# EAGLE schematic page1 (EAGLE 7.7.0)

## Sheet 1 of 3
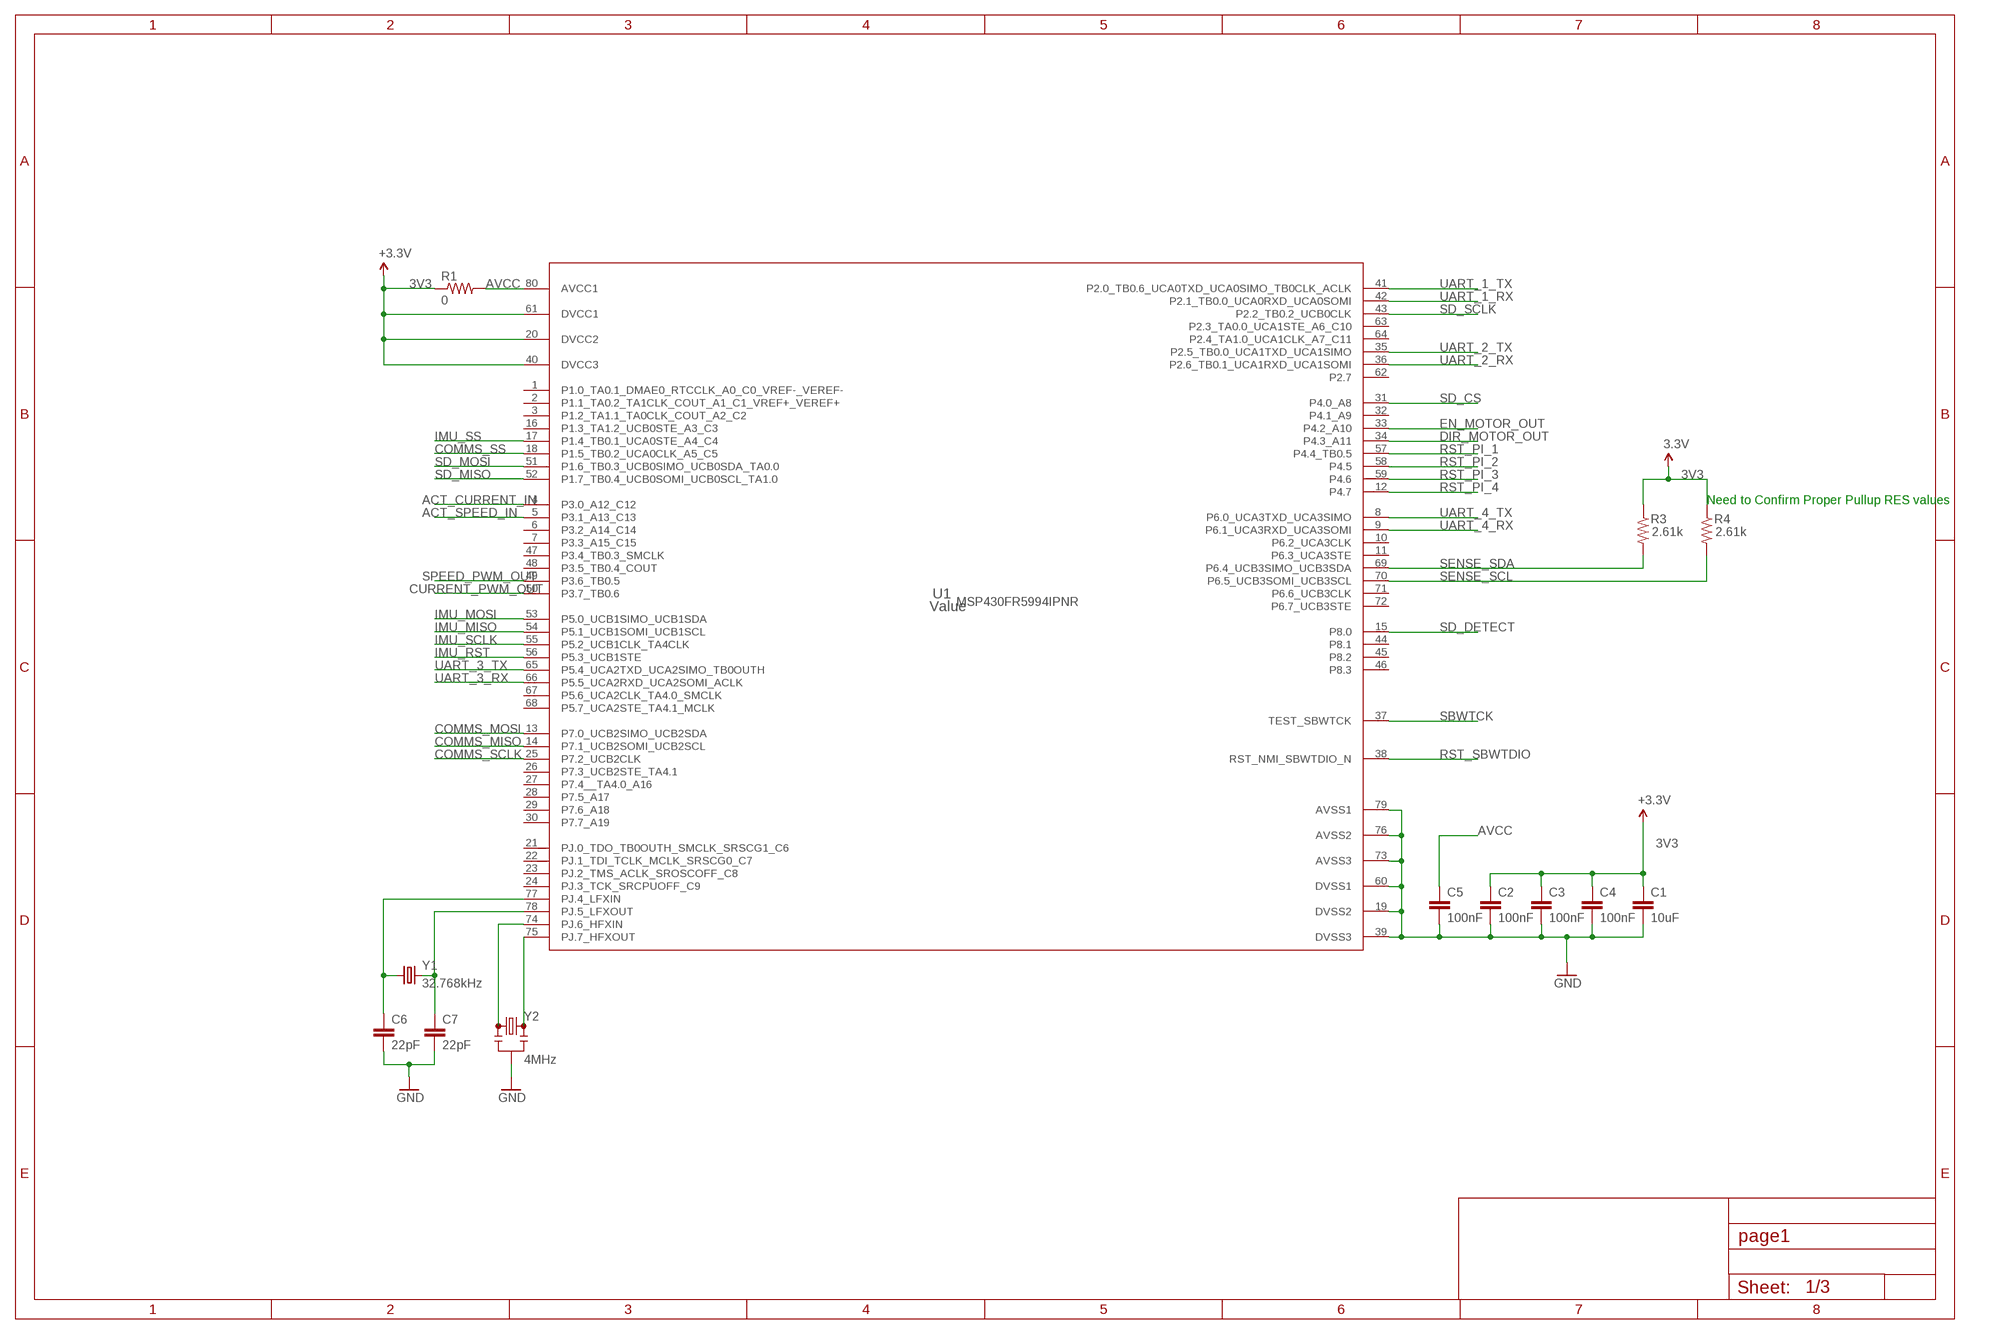
[diagram p0: schematic, sheet 1]

### Parts
C1  10uF  CAP_10UF0_0603  [C0603]
C2  100nF  CAP_100NF0_0603  [C0603]
C3  100nF  CAP_100NF0_0603  [C0603]
C4  100nF  CAP_100NF0_0603  [C0603]
C5  100nF  CAP_100NF0_0603  [C0603]
C6  22pF  CAP_22PF0_0603  [C0603]
C7  22pF  CAP_22PF0_0603  [C0603]
R1  0  RES_0R0_0603  [R0603]
R3  2.61k  RES_2R61_0603  [R0603]
R4  2.61k  RES_2R61_0603  [R0603]
U1  Value  MSP430FR5994IPNR  [PN0080A_N]
Y1  32.768kHz  CRYSTAL3.2X1.5MM  [CRYSTAL-SMD-3.2X1.5MM]
Y2  4MHz  RESONATOR4MHZ  [RESONATOR-SMD_MED]

### Nets
3V3: C1.1 C2.1 C3.1 C4.1 R1.1 R3.1 R4.1 U1.20(DVCC2) U1.40(DVCC3) U1.61(DVCC1) ; supply symbol labelled +3.3V, 3.3V ; also sheet 2,3
ACT_CURRENT_IN: U1.4(P3.0_A12_C12) ; also sheet 2
ACT_SPEED_IN: U1.5(P3.1_A13_C13) ; also sheet 2
AVCC: C5.1 R1.2 U1.80(AVCC1)
COMMS_MISO: U1.14(P7.1_UCB2SOMI_UCB2SCL) ; also sheet 2
COMMS_MOSI: U1.13(P7.0_UCB2SIMO_UCB2SDA) ; also sheet 2
COMMS_SCLK: U1.25(P7.2_UCB2CLK) ; also sheet 2
COMMS_SS: U1.18(P1.5_TB0.2_UCA0CLK_A5_C5) ; also sheet 2
CURRENT_PWM_OUT: U1.50(P3.7_TB0.6) ; also sheet 2
DIR_MOTOR_OUT: U1.34(P4.3_A11) ; also sheet 2
EN_MOTOR_OUT: U1.33(P4.2_A10) ; also sheet 2
GND: C1.2 C2.2 C3.2 C4.2 C5.2 C6.2 C7.2 U1.19(DVSS2) U1.39(DVSS3) U1.60(DVSS1) U1.73(AVSS3) U1.76(AVSS2) U1.79(AVSS1) Y2.2 ; also sheet 2,3
IMU_MISO: U1.54(P5.1_UCB1SOMI_UCB1SCL) ; also sheet 3
IMU_MOSI: U1.53(P5.0_UCB1SIMO_UCB1SDA) ; also sheet 3
IMU_RST: U1.56(P5.3_UCB1STE) ; also sheet 3
IMU_SCLK: U1.55(P5.2_UCB1CLK_TA4CLK) ; also sheet 3
IMU_SS: U1.17(P1.4_TB0.1_UCA0STE_A4_C4) ; also sheet 3
N$1: C6.1 U1.77(PJ.4_LFXIN) Y1.P$1
N$2: C7.1 U1.78(PJ.5_LFXOUT) Y1.P$2
N$3: U1.74(PJ.6_HFXIN) Y2.1
N$4: U1.75(PJ.7_HFXOUT) Y2.3
RST_PI_1: U1.57(P4.4_TB0.5) ; also sheet 2
RST_PI_2: U1.58(P4.5) ; also sheet 2
RST_PI_3: U1.59(P4.6) ; also sheet 2
RST_PI_4: U1.12(P4.7) ; also sheet 2
RST_SBWTDIO: U1.38(RST_NMI_SBWTDIO_N) ; also sheet 2
SBWTCK: U1.37(TEST_SBWTCK) ; also sheet 2
SD_CS: U1.31(P4.0_A8) ; also sheet 2
SD_DETECT: U1.15(P8.0)
SD_MISO: U1.52(P1.7_TB0.4_UCB0SOMI_UCB0SCL_TA1.0) ; also sheet 2
SD_MOSI: U1.51(P1.6_TB0.3_UCB0SIMO_UCB0SDA_TA0.0) ; also sheet 2
SD_SCLK: U1.43(P2.2_TB0.2_UCB0CLK) ; also sheet 2
SENSE_SCL: R4.2 U1.70(P6.5_UCB3SOMI_UCB3SCL) ; also sheet 3
SENSE_SDA: R3.2 U1.69(P6.4_UCB3SIMO_UCB3SDA) ; also sheet 3
SPEED_PWM_OUT: U1.49(P3.6_TB0.5) ; also sheet 2
UART_1_RX: U1.42(P2.1_TB0.0_UCA0RXD_UCA0SOMI) ; also sheet 2
UART_1_TX: U1.41(P2.0_TB0.6_UCA0TXD_UCA0SIMO_TB0CLK_ACLK) ; also sheet 2
UART_2_RX: U1.36(P2.6_TB0.1_UCA1RXD_UCA1SOMI) ; also sheet 2
UART_2_TX: U1.35(P2.5_TB0.0_UCA1TXD_UCA1SIMO) ; also sheet 2
UART_3_RX: U1.66(P5.5_UCA2RXD_UCA2SOMI_ACLK) ; also sheet 2
UART_3_TX: U1.65(P5.4_UCA2TXD_UCA2SIMO_TB0OUTH) ; also sheet 2
UART_4_RX: U1.9(P6.1_UCA3RXD_UCA3SOMI) ; also sheet 2
UART_4_TX: U1.8(P6.0_UCA3TXD_UCA3SIMO) ; also sheet 2
Unconnected: U1.1(P1.0_TA0.1_DMAE0_RTCCLK_A0_C0_VREF-_VEREF-) U1.2(P1.1_TA0.2_TA1CLK_COUT_A1_C1_VREF+_VEREF+) U1.3(P1.2_TA1.1_TA0CLK_COUT_A2_C2) U1.6(P3.2_A14_C14) U1.7(P3.3_A15_C15) U1.10(P6.2_UCA3CLK) U1.11(P6.3_UCA3STE) U1.16(P1.3_TA1.2_UCB0STE_A3_C3) U1.21(PJ.0_TDO_TB0OUTH_SMCLK_SRSCG1_C6) U1.22(PJ.1_TDI_TCLK_MCLK_SRSCG0_C7) U1.23(PJ.2_TMS_ACLK_SROSCOFF_C8) U1.24(PJ.3_TCK_SRCPUOFF_C9) U1.26(P7.3_UCB2STE_TA4.1) U1.27(P7.4__TA4.0_A16) U1.28(P7.5_A17) U1.29(P7.6_A18) U1.30(P7.7_A19) U1.32(P4.1_A9) U1.44(P8.1) U1.45(P8.2) U1.46(P8.3) U1.47(P3.4_TB0.3_SMCLK) U1.48(P3.5_TB0.4_COUT) U1.62(P2.7) U1.63(P2.3_TA0.0_UCA1STE_A6_C10) U1.64(P2.4_TA1.0_UCA1CLK_A7_C11) U1.67(P5.6_UCA2CLK_TA4.0_SMCLK) U1.68(P5.7_UCA2STE_TA4.1_MCLK) U1.71(P6.6_UCB3CLK) U1.72(P6.7_UCB3STE)

### Notes on the sheet
- Need to Confirm Proper Pullup RES values

## Sheet 2 of 3
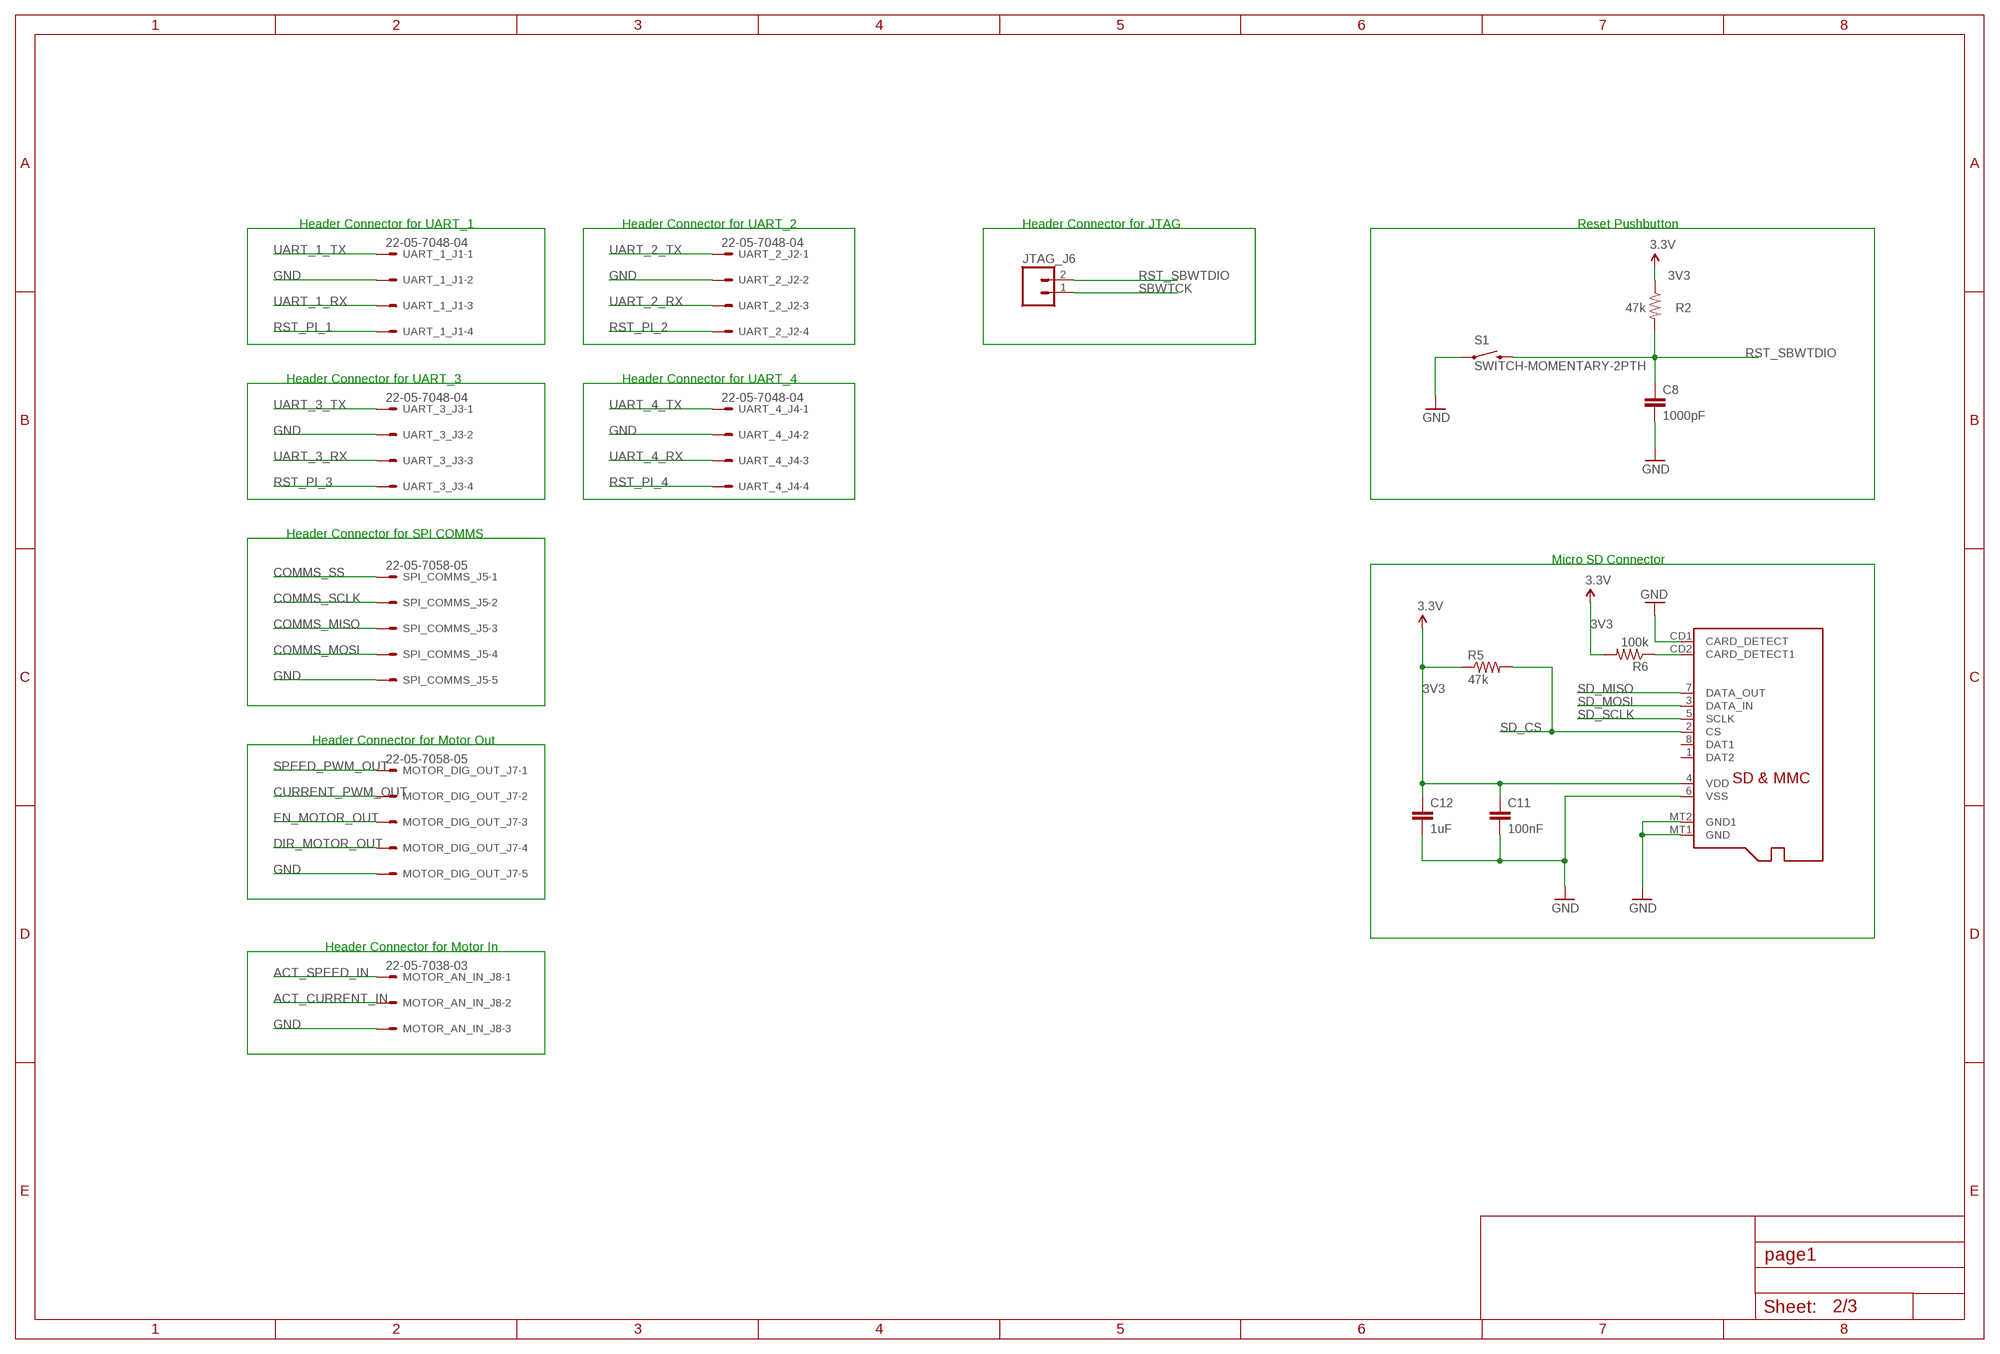
[diagram p1: schematic, sheet 2]

### Parts
C8  1000pF  CAP_1000PF0_0603  [C0603]
C11  100nF  CAP_100NF0_0603  [C0603]
C12  1uF  CAP_1UF0_0603  [C0603]
JTAG_J6  M02PTH  [1X02]
MOTOR_AN_IN_J8  22-05-7038-03  [7395-03]
MOTOR_DIG_OUT_J7  22-05-7058-05  [7395-05]
R2  47k  RES_47R0_0603  [R0603]
R5  47k  RES_47R0_0603  [R0603]
R6  100k  RES_100R0_0603  [R0603]
S1  SWITCH-MOMENTARY-2PTH  [TACTILE-PTH]
SPI_COMMS_J5  22-05-7058-05  [7395-05]
U$1  MICROSD  [MICROSD]
UART_1_J1  22-05-7048-04  [7395-04]
UART_2_J2  22-05-7048-04  [7395-04]
UART_3_J3  22-05-7048-04  [7395-04]
UART_4_J4  22-05-7048-04  [7395-04]

### Nets
3V3: C11.1 C12.1 R2.1 R5.1 R6.2 U$1.4(VDD) ; supply symbol labelled 3.3V ; also sheet 1,3
ACT_CURRENT_IN: MOTOR_AN_IN_J8.2 ; also sheet 1
ACT_SPEED_IN: MOTOR_AN_IN_J8.1 ; also sheet 1
COMMS_MISO: SPI_COMMS_J5.3 ; also sheet 1
COMMS_MOSI: SPI_COMMS_J5.4 ; also sheet 1
COMMS_SCLK: SPI_COMMS_J5.2 ; also sheet 1
COMMS_SS: SPI_COMMS_J5.1 ; also sheet 1
CURRENT_PWM_OUT: MOTOR_DIG_OUT_J7.2 ; also sheet 1
DIR_MOTOR_OUT: MOTOR_DIG_OUT_J7.4 ; also sheet 1
EN_MOTOR_OUT: MOTOR_DIG_OUT_J7.3 ; also sheet 1
GND: C8.2 C11.2 C12.2 MOTOR_AN_IN_J8.3 MOTOR_DIG_OUT_J7.5 S1.1 SPI_COMMS_J5.5 U$1.6(VSS) U$1.CD1(CARD_DETECT) U$1.MT1(GND) U$1.MT2(GND1) UART_1_J1.2 UART_2_J2.2 UART_3_J3.2 UART_4_J4.2 ; also sheet 1,3
N$18: R6.1 U$1.CD2(CARD_DETECT1)
RST_PI_1: UART_1_J1.4 ; also sheet 1
RST_PI_2: UART_2_J2.4 ; also sheet 1
RST_PI_3: UART_3_J3.4 ; also sheet 1
RST_PI_4: UART_4_J4.4 ; also sheet 1
RST_SBWTDIO: C8.1 JTAG_J6.2 R2.2 S1.3 ; also sheet 1
SBWTCK: JTAG_J6.1 ; also sheet 1
SD_CS: R5.2 U$1.2(CS) ; also sheet 1
SD_MISO: U$1.7(DATA_OUT) ; also sheet 1
SD_MOSI: U$1.3(DATA_IN) ; also sheet 1
SD_SCLK: U$1.5(SCLK) ; also sheet 1
SPEED_PWM_OUT: MOTOR_DIG_OUT_J7.1 ; also sheet 1
UART_1_RX: UART_1_J1.3 ; also sheet 1
UART_1_TX: UART_1_J1.1 ; also sheet 1
UART_2_RX: UART_2_J2.3 ; also sheet 1
UART_2_TX: UART_2_J2.1 ; also sheet 1
UART_3_RX: UART_3_J3.3 ; also sheet 1
UART_3_TX: UART_3_J3.1 ; also sheet 1
UART_4_RX: UART_4_J4.3 ; also sheet 1
UART_4_TX: UART_4_J4.1 ; also sheet 1
Unconnected: U$1.1(DAT2) U$1.8(DAT1)

### Notes on the sheet
- Header Connector for UART_1 | Header Connector for UART_2 | Header Connector for JTAG | Reset Pushbutton
- Header Connector for UART_3 | Header Connector for UART_4
- Header Connector for SPI COMMS
- Micro SD Connector
- Header Connector for Motor Out
- Header Connector for Motor In

## Sheet 3 of 3
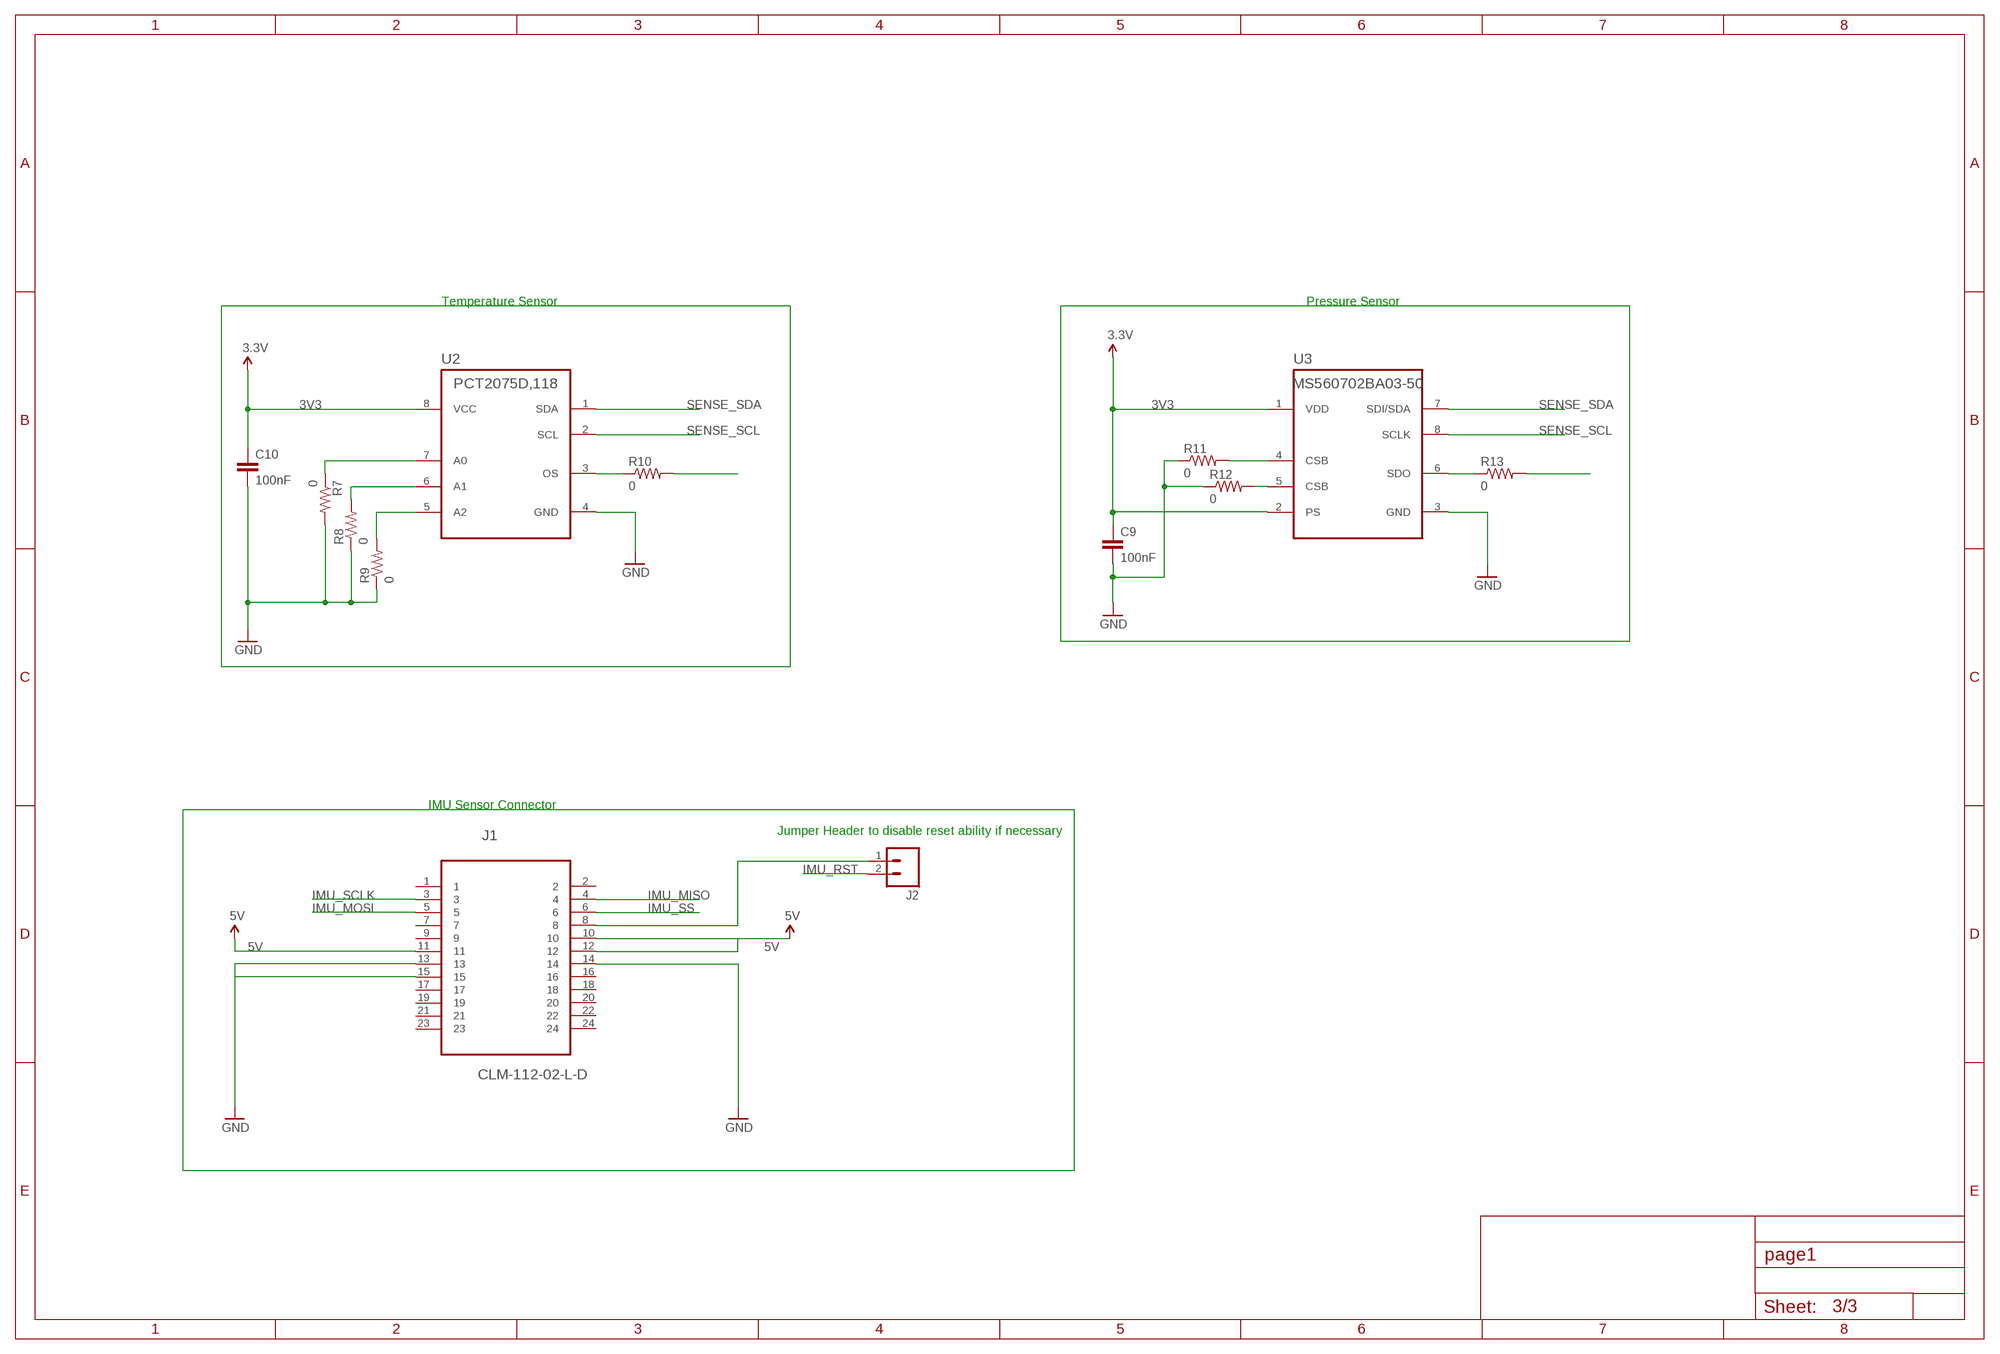
[diagram p2: schematic, sheet 3]

### Parts
C9  100nF  CAP_100NF0_0603  [C0603]
C10  100nF  CAP_100NF0_0603  [C0603]
J1  CLM-112-02-L-D  [SAMTEC_CLM-112-02-L-D]
J2  M02PTH  [1X02]
R7  0  RES_0R0_0603  [R0603]
R8  0  RES_0R0_0603  [R0603]
R9  0  RES_0R0_0603  [R0603]
R10  0  RES_0R0_0603  [R0603]
R11  0  RES_0R0_0603  [R0603]
R12  0  RES_0R0_0603  [R0603]
R13  0  RES_0R0_0603  [R0603]
U2  PCT2075D,118  PCT2075D,118SOIC8  [SOIC127P130X0600-8N]
U3  MS560702BA03-50  MS5607-02BA03_8SMD  [SMD125P110X060-8N]

### Nets
3V3: C9.1 C10.1 U2.8(VCC) U3.1(VDD) U3.2(PS) ; supply symbol labelled 3.3V ; also sheet 1,2
5V: J1.10 J1.11 J1.12
GND: C9.2 C10.2 J1.13 J1.14 J1.15 R7.2 R8.1 R9.1 R11.1 R12.1 U2.4(GND) U3.3(GND) ; also sheet 1,2
IMU_MISO: J1.4 ; also sheet 1
IMU_MOSI: J1.5 ; also sheet 1
IMU_RST: J2.2 ; also sheet 1
IMU_SCLK: J1.3 ; also sheet 1
IMU_SS: J1.6 ; also sheet 1
N$17: J1.8 J2.1
N$20: R7.1 U2.7(A0)
N$21: R8.2 U2.6(A1)
N$22: R9.2 U2.5(A2)
N$23: R11.2 U3.4(CSB)
N$24: R12.2 U3.5(CSB)
N$25: R13.1 U3.6(SDO)
N$26: R10.1 U2.3(OS)
N$27: R10.2
N$28: R13.2
SENSE_SCL: U2.2(SCL) U3.8(SCLK) ; also sheet 1
SENSE_SDA: U2.1(SDA) U3.7(SDI/SDA) ; also sheet 1
Unconnected: J1.1 J1.2 J1.7 J1.9 J1.16 J1.17 J1.18 J1.19 J1.20 J1.21 J1.22 J1.23 J1.24

### Notes on the sheet
- Temperature Sensor | Pressure Sensor
- IMU Sensor Connector
- Jumper Header to disable reset ability if necessary

## Library data of the parts
C1 = daqcs_host:CAP: Chip Capacitor; MANUFACTURER: Murata; MANUFACTURER_PN: GRM188R61A106KE69D; TEMP_COEFF: X5R; TOLERANCE: 10%; VENDOR: Digi-key; VENDOR_PN: 490-10474-1-ND; VOLTAGE: 10V
C2-C5 C9-C11 = daqcs_host:CAP: Chip Capacitor; MANUFACTURER: Murata; MANUFACTURER_PN: GRM188R71C104KA01D; TEMP_COEFF: X7R; TOLERANCE: 10%; VENDOR: Digi-key; VENDOR_PN: 490-1532-1-ND; VOLTAGE: 16V
C6 C7 = daqcs_host:CAP: Chip Capacitor; MANUFACTURER: Murata; MANUFACTURER_PN: GQM1885C1H220JB01D; TEMP_COEFF: C0G; TOLERANCE: 5%; VENDOR: Digi-Key; VENDOR_PN: 490-3575-2-ND; VOLTAGE: 50V
C8 = daqcs_host:CAP: Chip Capacitor; MANUFACTURER: Murata; MANUFACTURER_PN: GRM188R71H102KA01D; TEMP_COEFF: X7R; TOLERANCE: 10%; VENDOR: Digi-key; VENDOR_PN: 490-1494-2-ND; VOLTAGE: 50V
C12 = daqcs_host:CAP: Chip Capacitor; MANUFACTURER: Murata; MANUFACTURER_PN: GRM033R61A105ME15D; TEMP_COEFF: X5R; TOLERANCE: 20%; VENDOR: Digi-key; VENDOR_PN: 490-13226-1-ND; VOLTAGE: 10V
J1 = SAMTEC-BCS-CES-CLx_By_element14_Batch_1:CLM-112-02-L-D: MICRO SOCKET, 1.0MM, SMD, 2X12WAY; MPN: CLM-112-02-L-D; OC_FARNELL: 1885921; OC_NEWARK: 11P3763; PACKAGE: MICRO SOCKET, 1.0MM, SMD, 2X12WAY; SUPPLIER: SAMTEC
J2 JTAG_J6 = SparkFun-Connectors:M02: Standard 2-pin 0.1" header. Use with - straight break away headers ( PRT-00116) - right angle break away headers (PRT-00553) - swiss pins (PRT-00743) - machine pins (PRT-00117) - female headers (PRT-00115) Molex polarized connector foot print use with: PRT-08233 with associated crimp pins and housings. 2.54_SCREWTERM for use with PRT-10571. 3.5mm Screw Terminal footprints for PRT-08084 5mm Screw Terminal footprints for use with PRT-08432
MOTOR_AN_IN_J8 = con-molex:22-?-03: CONNECTOR wire to board 2.54 mm (.1 inch) pitch header; OC_FARNELL: unknown; OC_NEWARK: unknown
MOTOR_DIG_OUT_J7 SPI_COMMS_J5 = con-molex:22-?-05: CONNECTOR wire to board 2.54 mm (.1 inch) pitch header; OC_FARNELL: unknown; OC_NEWARK: unknown
R1 R7-R13 = daqcs_host:RES: Chip Resistor; MANUFACTURER: Panasonic; MANUFACTURER_PN: ERJ-3GEY0R00V; POWER: 1/10W; TOLERANCE: JUMPER; VENDOR: Digi-key; VENDOR_PN: P0.0GCT-ND
R2 R5 = daqcs_host:RES: Chip Resistor; MANUFACTURER: Panasonic; MANUFACTURER_PN: ERJ-3EKF4702V; POWER: 1/10W; TOLERANCE: 1%; VENDOR: Digi-key; VENDOR_PN: P47.0KHTR-ND
R3 R4 = daqcs_host:RES: Chip Resistor; MANUFACTURER: Panasonic; MANUFACTURER_PN: ERJ-3EKF2611V; POWER: 1/10W; TOLERANCE: 1%; VENDOR: Digi-key; VENDOR_PN: P2.61KHTR-ND
R6 = daqcs_host:RES: Chip Resistor; MANUFACTURER: Panasonic; MANUFACTURER_PN: ERJ-3EKF1003V; POWER: 1/10W; TOLERANCE: 1%; VENDOR: Digi-key; VENDOR_PN: P100KHCT-ND
S1 = SparkFun-Electromechanical:SWITCH-MOMENTARY-2: Various NO switches- pushbuttons, reed, etc; PROD_ID: SWCH-08441
U1 = daqcs_host:MSP430FR5994IPNR; MANUFACTURER: Texas Instruments; PARTNUMBER: MSP430FR5994IPNR; REFDES: RefDes; TYPE: TYPE
U2 = daqcs_host:PCT2075: I2C-bus Fm+, 1 degree C accuracy, digital temperature sensor and thermal watchdog; INTERFACE: I2C; MANUFACTURER: NXP; MANUFACTURER_PN: PCT2075D,118; RESOLUTION: 10b; VENDOR: Digi-key; VENDOR_PN: 568-10219-1-ND
U3 = daqcs_host:MS5607: Barometric Pressure Sensor, with stainless steel cap Specs High resolution module, 20cm Fast conversion down to 1 ms Low power, 1 μA (standby < 0.15 μA) QFN package 5.0 x 3.0 x 1.0 mm3 Supply voltage 1.8 to 3.6 V Integrated digital pressure sensor (24 bit ΔΣ ADC) Operating range: 10 to 1200 mbar, -40 to +85 °C I2C and SPI interface up to 20 MHz No external components (Internal oscillator) Excellent long term stability; INTERFACE: I2C,SPI; MANUFACTURER: TE Connectivity; MANUFACTURER_PN: MS560702BA03-50; OUTPUT_BITS: 24b; PRESSURE_TYPE: Absolute; VENDOR: Digi-key; VENDOR_PN: 223-1198-1-ND
U$1 = daqcs_host:MICROSD: Micro-SD / Transflash card holder with SPI pinout For the 3M # 2908-05WB-MG and/or 4UCON #19656 push-push type
UART_1_J1 UART_2_J2 UART_3_J3 UART_4_J4 = con-molex:22-?-04: CONNECTOR wire to board 2.54 mm (.1 inch) pitch header; OC_FARNELL: unknown; OC_NEWARK: unknown
Y1 = SparkFun-FreqCtrl:CRYSTAL: Various standard crystals. Proven footprints.; PROD_ID: XTAL-13062
Y2 = SparkFun-FreqCtrl:RESONATOR: Resonator Small SMD resonator. Used, eg, on the Arduino Pro/ Pro Mini boards. 8MHz- XTAL-08895 16MHz- XTAL-08900; PROD_ID: XTAL-12492